# EAGLE design MovingTargetUnit_v5 (EAGLE 9.6.2)
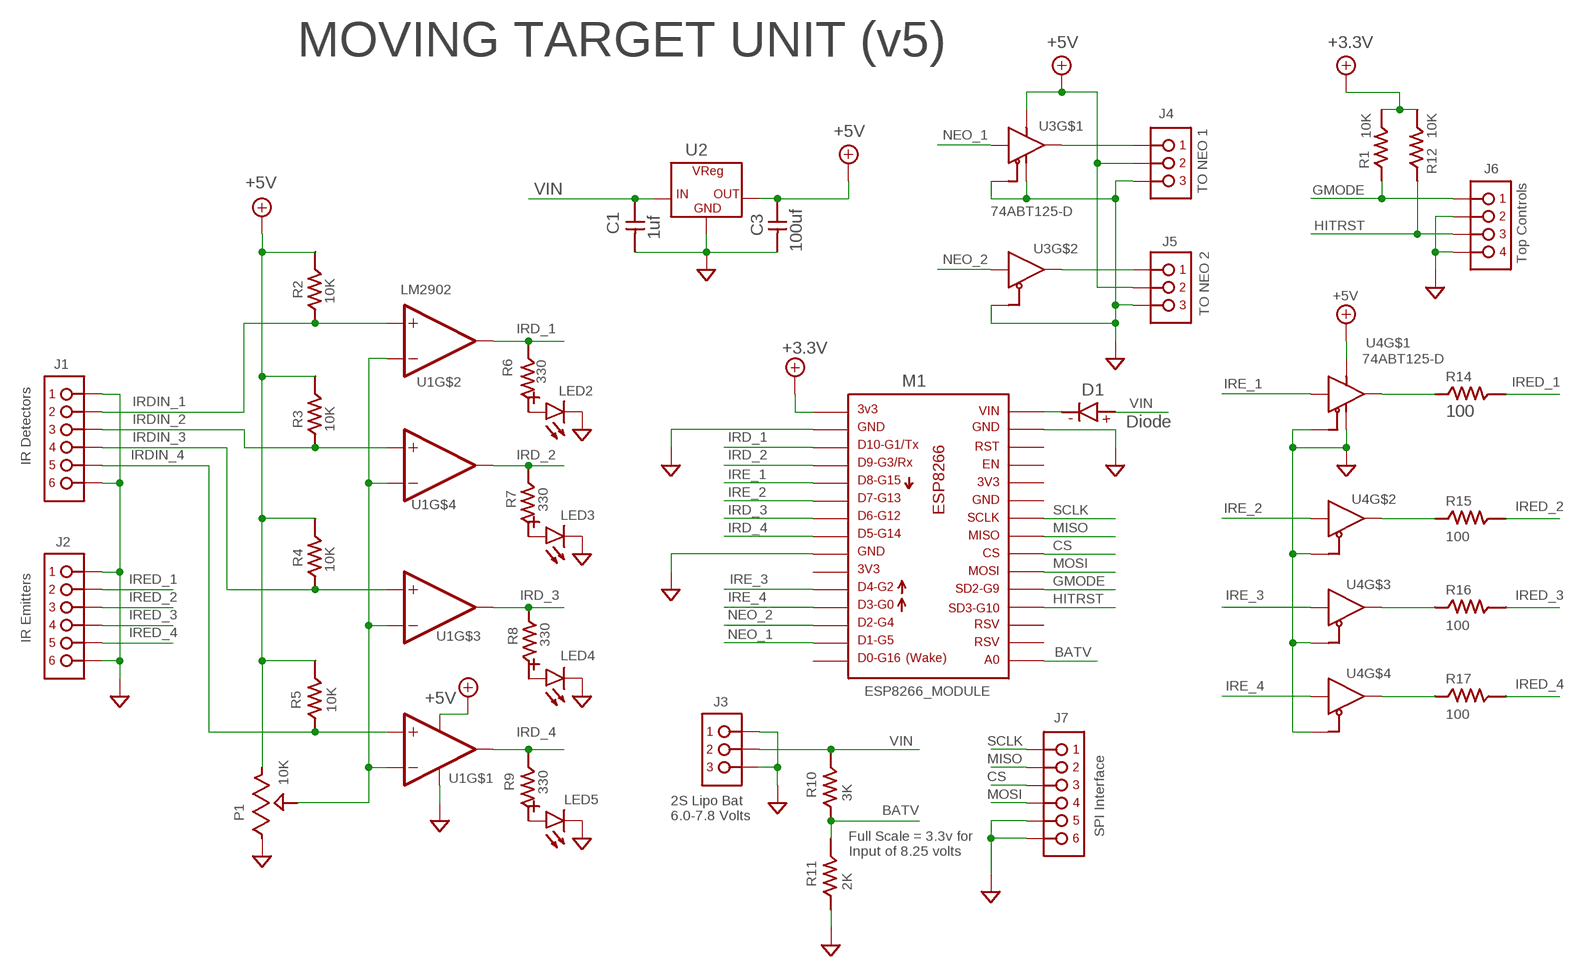
[diagram p0: schematic, sheet 1]

## Parts
C1  1uf  CAP1206  [C1206]
C3  100uf  CAP1206  [C1206]
D1  Diode  DIODE-SOD_87  [SOD-123_MINI-SMA]
J1  PINHDR_1X6-JST  [JST-XH_098_VERT_1X6]
J2  PINHDR_1X6-JST  [JST-XH_098_VERT_1X6]
J3  PINHDR_1X3XH-JST  [JST-XH_098_VERT_1X3]
J4  PINHDR_1X3XH-JST  [JST-XH_098_VERT_1X3]
J5  PINHDR_1X3XH-JST  [JST-XH_098_VERT_1X3]
J6  PINHDR_1X4-JST  [JST-XH_098_VERT_1X4]
J7  PINHDR_1X6-JST  [JST-XH_098_VERT_1X6]
LED2  LED1206  [LED_1206]
LED3  LED1206  [LED_1206]
LED4  LED1206  [LED_1206]
LED5  LED1206  [LED_1206]
M1  ESP8266_MODULE  [ESP8266_MODULE]
P1  10K  TRIMPOT-SM  [TRIMPOT_3361P]
R1  10K  R1206(3216METRIC)  [R1206]
R2  10K  R1206(3216METRIC)  [R1206]
R3  10K  R1206(3216METRIC)  [R1206]
R4  10K  R1206(3216METRIC)  [R1206]
R5  10K  R1206(3216METRIC)  [R1206]
R6  330  R1206(3216METRIC)  [R1206]
R7  330  R1206(3216METRIC)  [R1206]
R8  330  R1206(3216METRIC)  [R1206]
R9  330  R1206(3216METRIC)  [R1206]
R10  3K  R1206(3216METRIC)  [R1206]
R11  2K  R1206(3216METRIC)  [R1206]
R12  10K  R1206(3216METRIC)  [R1206]
R14  100  R1206(3216METRIC)  [R1206]
R15  100  R1206(3216METRIC)  [R1206]
R16  100  R1206(3216METRIC)  [R1206]
R17  100  R1206(3216METRIC)  [R1206]
U1  LM2902  [SO16LNB-14PIN]
U2  VREG-3-HS  [TO252-3-HS]
U3  74ABT125-D  [SO16LNB-14PIN]
U4  74ABT125-D  [SO16LNB-14PIN]

## Nets
+3.3V: M1.P$1 R1.P$2 R12.P$2
+5V: C3.P$2 J4.2 J5.2 P1.3 R2.P$2 R3.P$2 R4.P$2 R5.P$2 U1.P$4(P+) U2.3(OUT) U3.P$14(VCC) U4.P$14(VCC)
BATV: M1.P$16 R10.P$1 R11.P$2
CS: J7.4 M1.P$22
GMODE: J6.1 M1.P$20 R1.P$1
GND: C1.P$1 C3.P$1 J1.1 J1.6 J2.1 J2.6 J3.1 J3.3 J4.1 J5.1 J6.2 J6.4 J7.1 J7.2 LED2.CATHODE(-)(CATHODE) LED3.CATHODE(-)(CATHODE) LED4.CATHODE(-)(CATHODE) LED5.CATHODE(-)(CATHODE) M1.P$2 M1.P$9 M1.P$29 P1.1 R11.P$1 U1.P$11(P-) U2.FIN(GND) U3.P$1(OE) U3.P$4(OE) U3.P$7(GND) U4.P$1(OE) U4.P$4(OE) U4.P$7(GND) U4.P$10(OE) U4.P$13(OE)
HITRST: J6.3 M1.P$19 R12.P$1
IRD_1: M1.P$3 R6.P$2 U1.P$7(OUT)
IRD_2: M1.P$4 R7.P$2 U1.P$14(OUT)
IRD_3: M1.P$7 R8.P$1 U1.P$8(OUT)
IRD_4: M1.P$8 R9.P$2 U1.P$1(OUT)
IRDIN_1: J1.5 R2.P$1 U1.P$5(+IN)
IRDIN_2: J1.4 R3.P$1 U1.P$12(+IN)
IRDIN_3: J1.3 R4.P$1 U1.P$10(+IN)
IRDIN_4: J1.2 R5.P$1 U1.P$3(+IN)
IRE_1: M1.P$5 U4.P$2(IN)
IRE_2: M1.P$6 U4.P$5(IN)
IRE_3: M1.P$11 U4.P$9(IN)
IRE_4: M1.P$12 U4.P$12(IN)
IRED_1: J2.5 R14.P$2
IRED_2: J2.4 R15.P$2
IRED_3: J2.3 R16.P$2
IRED_4: J2.2 R17.P$2
IREDD_1: R14.P$1 U4.P$3(OUT)
IREDD_2: R15.P$1 U4.P$6(OUT)
IREDD_3: R16.P$1 U4.P$8(OUT)
IREDD_4: R17.P$1 U4.P$11(OUT)
MISO: J7.5 M1.P$23
MOSI: J7.3 M1.P$21
N$1: LED3.ANODE(+)(ANODE) R7.P$1
N$2: LED2.ANODE(+)(ANODE) R6.P$1
N$3: LED4.ANODE(+)(ANODE) R8.P$2
N$4: LED5.ANODE(+)(ANODE) R9.P$1
N$5: J5.3 U3.P$6(OUT)
N$6: J4.3 U3.P$3(OUT)
N$7: D1.C(CATHODE) M1.P$30
N$10: P1.2 U1.P$2(-IN) U1.P$6(-IN) U1.P$9(-IN) U1.P$13(-IN)
NEO_1: M1.P$14 U3.P$2(IN)
NEO_2: M1.P$13 U3.P$5(IN)
SCLK: J7.6 M1.P$24
VIN: C1.P$2 D1.A(ANODE) J3.2 R10.P$2 U2.1(IN)
Unconnected: M1.P$10 M1.P$15 M1.P$17 M1.P$18 M1.P$25 M1.P$26 M1.P$27 M1.P$28 U3.P$8(OUT) U3.P$9(IN) U3.P$10(OE) U3.P$11(OUT) U3.P$12(IN) U3.P$13(OE)

## Notes on the sheet
- MOVING TARGET UNIT (v5)
- Top Controls
- TO NEO 1
- TO NEO 2
- IR Detectors
- IR Emitters
- 2S Lipo Bat
  6.0-7.8 Volts
- SPI Interface
- Full Scale = 3.3v for 
  Input of 8.25 volts

## Library data of the parts
C1 C3 = Dal_V2:CAP
D1 = Dal_V2:DIODE
J1 J2 J7 = Dal_V2:PINHDR_1X6
J3-J5 = Dal_V2:PINHDR_1X3
J6 = Dal_V2:PINHDR_1X4
LED2-LED5 = Dal_V2:LED: Standard LED
M1 = Dal_V2:ESP8266_MODULE
P1 = Dal_V2:TRIMPOT
R1-R12 R14-R17 = Dal_V2:R: Standard Resistor -- Various Sizes and Wattages
U1 = Dal_V2:LM2902: Texas Instruments, LM2902KD
U2 = Dal_V2:VREG-3: 3 Pin Voltage Regulator
U3 U4 = Dal_V2:74ABT125

## Board
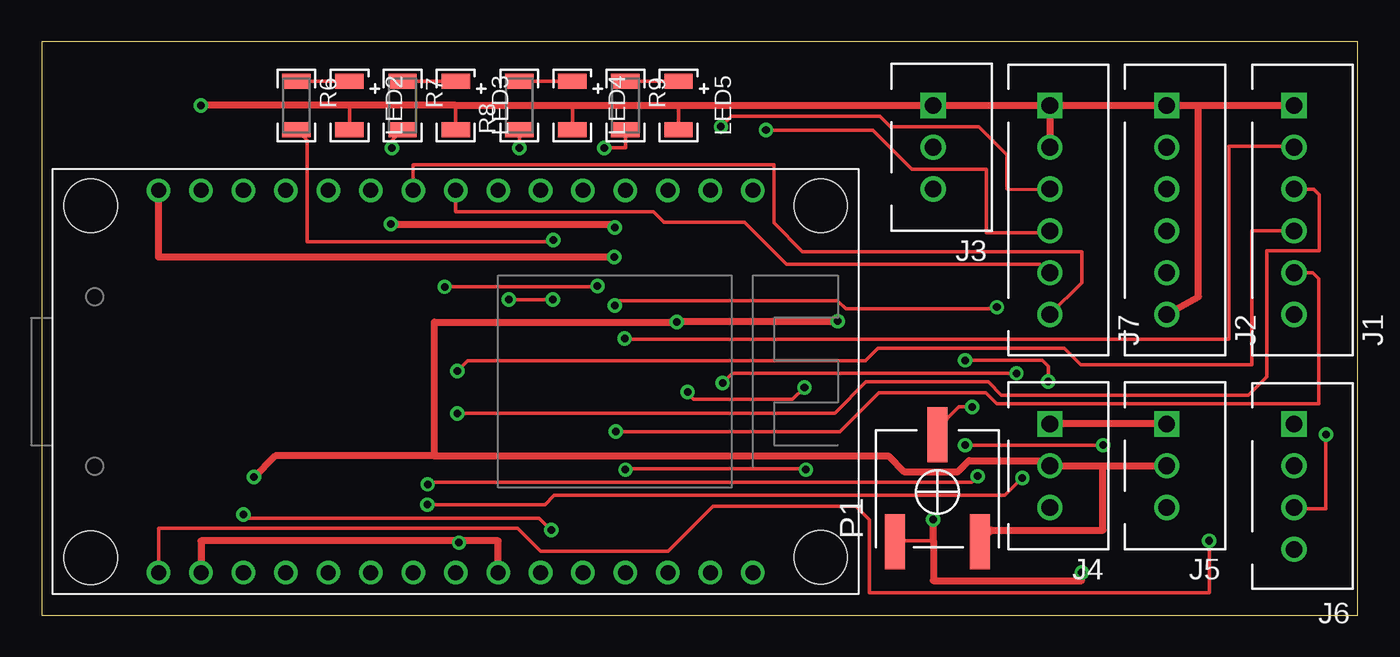
[diagram p1: board, top side]
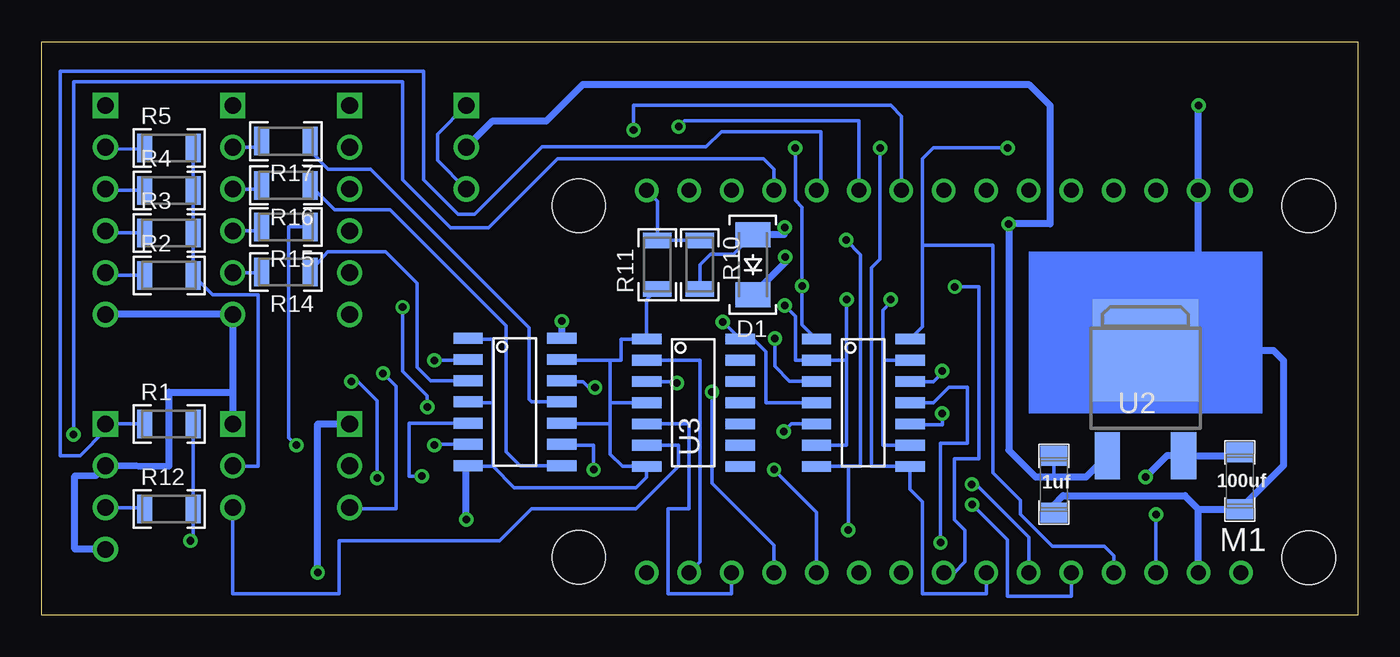
[diagram p2: board, bottom side, seen from below]

Size 78.74 x 34.29 mm. Coordinates in mm from the lower left corner, seen from the top.
Outline: 0,0 78.74,0 78.74,34.29 0,34.29 0,0
Copper layers (1*16): Top 0.035mm / dielectric 1.5mm / Bottom 0.035mm
Design rules "default *": minimum track width 8mil, minimum drill 0.44mm, track to track 8mil, track to pad 8mil, pad to pad 8mil, via to via 8mil, smd to smd 8mil, copper to edge 40mil, drill to drill 8mil, minimum pad ring 10mil, minimum via ring 8mil, stop-mask expansion 4mil, vias tented up to drill 0mil, thermal gap 10mil

### Footprints (pad centres in the part's own frame; a part is rotated, then mirrored left to right if it is on the bottom)
C1206 = smd 1.2 x 1.6: P$1 -1.7,0; P$2 1.7,0
SOD-123_MINI-SMA = smd 1.5 x 2.1: A 1.8,0; C -1.8,0
JST-XH_098_VERT_1X6 = drill 1 square: 1 0,0 | drill 1: 2 -2.5,0; 3 -5,0; 4 -7.5,0; 5 -10,0; 6 -12.5,0
JST-XH_098_VERT_1X3 = drill 1 square: 1 0,0 | drill 1: 2 -2.5,0; 3 -5,0
JST-XH_098_VERT_1X4 = drill 1 square: 1 0,0 | drill 1: 2 -2.5,0; 3 -5,0; 4 -7.5,0
LED_1206 = smd 0.9 x 1.7: ANODE(+) -1.45,0; CATHODE(-) 1.45,0
ESP8266_MODULE = drill 0.9: P$1 0,0; P$2 2.54,0; P$3 5.08,0; P$4 7.62,0; P$5 10.16,0; P$6 12.7,0; P$7 15.24,0; P$8 17.78,0; P$9 20.32,0; P$10 22.86,0; P$11 25.4,0; P$12 27.94,0; P$13 30.48,0; P$14 33.02,0; P$15 35.56,0; P$16 35.56,22.86; P$17 33.02,22.86; P$18 30.48,22.86; P$19 27.94,22.86; P$20 25.4,22.86; P$21 22.86,22.86; P$22 20.32,22.86; P$23 17.78,22.86; P$24 15.24,22.86; P$25 12.7,22.86; P$26 10.16,22.86; P$27 7.62,22.86; P$28 5.08,22.86; P$29 2.54,22.86; P$30 0,22.86 | hole 3.175: -4.064,21.946; -4.064,0.889; 39.624,21.946; 39.624,0.914
TRIMPOT_3361P = smd 1.2 x 3.3: 1 -2.54,-6.4; 2 0,0; 3 2.54,-6.4
R1206 = smd 0.9 x 1.7: P$1 -1.45,0; P$2 1.45,0
SO16LNB-14PIN = smd 1.75 x 0.65: P$1 0,0; P$2 0,-1.27; P$3 0,-2.54; P$4 0,-3.81; P$5 0,-5.08; P$6 0,-6.35; P$7 0,-7.62; P$8 5.6,-7.62; P$9 5.6,-6.35; P$10 5.6,-5.08; P$11 5.6,-3.81; P$12 5.6,-2.54; P$13 5.6,-1.27; P$14 5.6,0
TO252-3-HS = smd 1.5 x 2.8: 1 -2.28,-3.8; 3 2.28,-3.8 | smd 6.3 x 6.1: FIN 0,2.5

### Placement (x,y rotation side)
C1  18.19,7.82 90 bottom
C3  7.06,8.03 90 bottom
D1  36.2,20.95 90 bottom
J1  74.93,30.48 90 top
J2  67.31,30.48 90 top
J3  53.34,30.48 90 top
J4  60.33,11.43 90 top
J5  67.31,11.43 90 top
J6  74.93,11.43 90 top
J7  60.33,30.48 90 top
LED2  18.41,30.48 270 top
LED3  24.77,30.48 270 top
LED4  31.75,30.48 270 top
LED5  38.1,30.48 270 top
M1  6.99,2.54 0 top
P1  53.59,10.79 0 top
R1  71.12,11.43 0 bottom
R2  71.12,20.32 0 bottom
R3  71.12,22.86 0 bottom
R4  71.12,25.4 0 bottom
R5  71.12,27.94 0 bottom
R6  15.24,30.48 270 top
R7  21.59,30.48 270 top
R8  28.57,30.48 90 top
R9  34.92,30.48 270 top
R10  39.37,20.95 270 bottom
R11  41.91,20.95 90 bottom
R12  71.12,6.35 0 bottom
R14  64.14,20.52 180 bottom
R15  64.14,23.22 180 bottom
R16  64.14,25.7 180 bottom
R17  64.14,28.35 180 bottom
U1  32.38,16.51 0 bottom
U2  12.7,13.34 0 bottom
U3  42.55,16.51 0 bottom
U4  53.23,16.56 0 bottom

### Tracks (layer width: path | path; a pad name or v marks a point on that pad's centre or on a via)
+3.3V  (via drill 0.45)
  Top 0.203: M1.P$1 6.99,5.18 28.47,5.18 29.84,3.81 37.47,3.81 40.16,6.5 48.72,6.5 49.53,5.69 49.53,1.32 69.85,1.32 v69.85,4.45
  Bottom 0.203: R1.P$2 R12.P$2 69.67,4.62 v69.85,4.45
+5V  (via drill 0.45)
  Top 0.203: 37.85,17.55 37.82,17.53 v38,17.53
  Top 0.406: v12.7,8.26 13.97,9.53 23.5,9.53 | 23.5,9.53 50.66,9.53 51.6,8.59 54.83,8.59 55.48,9.24 60.02,9.24 J4.2 63.5,8.93 | 63.5,8.93 J5.2 | 23.5,9.53 23.5,17.53 v38,17.53 | v47.62,17.58 47.6,17.55 37.85,17.55 | P1.3 56.82,5.08 63.5,5.08 63.5,8.93
  Bottom 0.203: R5.P$2 R4.P$2 R3.P$2 R2.P$2 68.5,19.15 65.79,19.15 65.79,8.89 67.27,8.89 J5.2 | C3.P$2 7.25,9.54 | v38,17.53 37.96,17.53 U3.P$14 36.16,16.51 35.4,15.75 35.4,12.7 U1.P$4
  Bottom 0.406: v12.7,8.26 11.42,9.54 U2.3 7.25,9.54 | v47.62,17.58 U4.P$14
BATV
  Bottom 0.203: M1.P$16 41.91,24.77 R11.P$2 R10.P$1
CS  (via drill 0.45)
  Top 0.203: v43.33,29.01 49.73,29.01 52.07,26.67 56.52,26.67 56.52,22.86 60.2,22.86 J7.4
  Bottom 0.203: M1.P$22 27.3,29.84 27.94,30.48 43.33,30.48 v43.33,29.01
GMODE
  Bottom 0.203: R1.P$1 J6.1 74.93,11.05 76.45,9.53 77.62,9.53 77.62,32.54 55.88,32.54 55.88,26.04 53.82,23.98 52.86,23.98 48.82,28.02 38.99,28.02 38.08,28.92 32.13,28.92 32.13,25.65 M1.P$20
GND  (via drill 0.45)
  Top 0.203: LED2.CATHODE(-) 18.41,30.48 | 24.77,30.48 LED3.CATHODE(-) | LED4.CATHODE(-) 31.75,30.48 | 38.1,30.48 LED5.CATHODE(-) | P1.1 51.05,4.45 53.34,4.45 | 24.77,4.45 24.93,4.29 v24.97,4.33
  Top 0.406: J7.1 J3.1 38.1,30.48 31.75,30.48 24.77,30.48 18.41,30.48 v9.53,30.48 | J7.1 J2.1 69.22,30.48 | 69.22,30.48 J1.1 | J2.6 69.22,19.05 69.22,30.48 | J7.1 J7.2 | J5.1 J4.1 | M1.P$9 27.3,4.45 24.77,4.45 9.53,4.45 M1.P$2 | v62.23,2.54 62.23,2.06 53.34,2.06 53.34,4.45 v53.34,5.71
  Bottom 0.203: 51.74,8.89 53.17,8.89 U4.P$7 53.34,8.82 | U4.P$1 53.17,16.51 51.74,16.51 51.74,12.7 | 51.74,12.7 51.74,8.89 | J3.3 55.07,27.21 55.07,28.75 J3.1 | 44.73,11.43 44.73,9.63 43.99,8.89 U3.P$7 42.55,8.26 43.18,7.62 50.47,7.62 51.74,8.89 | 44.73,11.43 44.73,12.7 | 44.73,12.7 U3.P$4 | 44.73,12.7 44.73,15.24 | U4.P$13 47.58,15.24 44.73,15.24 | U4.P$10 47.58,11.43 44.73,11.43 | 44.73,15.24 44.09,15.24 44.09,16.51 U3.P$1 42.55,18.87 R11.P$1 | U4.P$4 53.17,12.7 51.74,12.7 | C1.P$1 18.19,6.58 | U1.P$11 25.4,12.7 24.46,13.64 23.34,13.64 23.34,10.29 24.97,10.29 v24.97,4.33
  Bottom 0.406: 67.31,13.34 J2.6 J1.6 | 67.31,13.34 J5.1 | 67.31,13.34 71.12,13.34 71.12,8.91 74.91,8.95 J6.2 75.5,8.36 76.76,8.33 76.76,3.94 J6.4 | M1.P$2 9.53,6.33 | v9.53,30.48 M1.P$29 9.53,19.01 U2.FIN 5.04,15.84 4.45,15.24 4.45,8.94 C3.P$1 9.53,6.33 | v62.23,2.54 62.23,11.43 J4.1 | v53.34,5.71 53.34,8.82 | 18.19,6.58 17.63,7.14 10.34,7.14 9.53,6.33
HITRST  (via drill 0.45)
  Top 0.203: J6.3 74.85,6.35 76.83,6.35 v76.83,10.79
  Bottom 0.203: R12.P$1 72.65,6.43 J6.3 | M1.P$19 34.92,26.67 35.56,27.3 47.88,27.3 52.02,23.16 54.28,23.16 57.15,26.04 57.15,31.9 76.83,31.9 v76.83,10.79
IRD_1  (via drill 0.45)
  Top 0.203: v30.61,22.43 30.5,22.33 15.88,22.33 15.88,28.39 R6.P$2 | v30.48,5.08 29.77,5.79 12.29,5.79 v12.06,6.02
  Bottom 0.203: U1.P$7 30.48,8.89 | 30.48,8.89 29.74,8.89 29.74,21.57 v30.61,22.43 | M1.P$3 v12.06,6.02 | v30.48,5.08 30.48,8.89
IRD_2  (via drill 0.45)
  Top 0.203: v20.95,27.94 20.95,28.39 R7.P$2
  Bottom 0.203: U1.P$14 26.04,17.26 26.04,22.12 | 26.04,22.12 26.04,27.3 25.4,27.94 v20.95,27.94 | 26.04,22.12 21.82,22.12 21.82,8.51 20.18,6.87 20.18,6.03 18.26,4.12 15.16,4.12 14.61,3.56 M1.P$4
IRD_3  (via drill 0.45)
  Top 0.203: v28.57,27.94 R8.P$1
  Bottom 0.203: M1.P$7 22.23,1.27 26.04,1.27 26.04,6.77 26.79,7.52 U1.P$8 29.08,8.89 29.08,20.78 28.57,21.29 v28.57,27.94
IRD_4  (via drill 0.45)
  Top 0.203: v24.11,19.63 33.2,19.63 v33.25,19.68 | v33.66,27.94 34.92,27.94 R9.P$2
  Bottom 0.203: U1.P$1 33.25,17.37 v33.25,19.68 33.25,24.4 33.66,24.8 v33.66,27.94 | v24.11,19.63 22.66,19.63 22.66,9.35 24.13,9.35 24.13,5.71 23.5,5.08 23.5,3.17 24.13,2.54 M1.P$8
IRDIN_1  (via drill 0.45)
  Top 0.203: J1.5 76.04,20.48 76.4,20.12 76.4,12.65 57.16,12.65 56.51,13.31 50.09,13.31 47.75,10.97 v34.34,10.97
  Bottom 0.203: R2.P$1 74.77,20.32 J1.5 | U1.P$5 33.88,11.43 v34.34,10.97
IRDIN_2  (via drill 0.45)
  Top 0.203: J1.4 72.41,22.98 72.42,22.85 72.42,14.99 62.18,14.99 61.2,15.97 50.03,15.97 49.28,15.21 25.47,15.21 v24.86,14.61
  Bottom 0.203: J1.4 74.83,22.88 74.48,22.86 R3.P$1 | U1.P$12 25.4,13.97 24.77,14.61 v24.86,14.61
IRDIN_3  (via drill 0.45)
  Top 0.203: v24.86,12.06 47.45,12.06 49.33,13.95 56.63,13.95 57.43,13.14 72.19,13.14 73.3,14.25 73.3,21.79 76.45,21.79 76.45,25.15 76.12,25.48 J1.3
  Bottom 0.203: R4.P$1 74.85,25.4 J1.3 | U1.P$10 26.73,11.38 24.86,11.38 v24.86,12.06
IRDIN_4  (via drill 0.45)
  Top 0.203: J1.2 74.87,28.04 71.02,28.04 71.02,16.51 65.15,16.51 34.9,16.51 v34.87,16.54
  Bottom 0.203: R5.P$1 72.66,27.85 74.84,27.89 J1.2 | U1.P$3 32.42,14 34,14 34.87,14.88 v34.87,16.54
IRE_1  (via drill 0.45)
  Top 0.203: v23.06,6.6 30.1,6.6 30.66,7.16 57.62,7.16 58.59,8.13 58.67,8.13 v58.67,8.2 | v55.24,15.24 59.87,15.24 60.22,14.88 v60.22,13.97
  Bottom 0.203: M1.P$5 17.14,1.12 20.95,1.12 20.95,4.5 v23.06,6.6 | v58.67,8.2 58.67,12.83 59.82,13.97 v60.22,13.97 | v55.24,15.24 53.27,15.24 U4.P$2
IRE_2  (via drill 0.45)
  Top 0.203: v23.09,7.82 23.22,7.95 55.65,7.95 v56.01,8.31
  Bottom 0.203: M1.P$6 19.68,4.65 22.86,7.82 v23.09,7.82 | v56.01,8.31 56.77,8.31 56.77,11.48 U4.P$5
IRE_3  (via drill 0.45)
  Top 0.203: v45.72,8.7 45.68,8.74 34.92,8.74 v34.92,8.7
  Bottom 0.203: U4.P$9 47.58,10.16 45.72,10.16 v45.72,8.7 | v34.92,8.7 32.38,6.16 M1.P$11
IRE_4  (via drill 0.45)
  Top 0.203: v38.64,13.34 38.64,13.26 39.01,12.89 44.92,12.89 v45.63,13.61
  Bottom 0.203: U4.P$12 47.58,13.97 46.35,13.97 45.99,13.61 v45.63,13.61 | v38.64,13.34 38.64,7.88 34.92,4.17 M1.P$12
IRED_1
  Bottom 0.203: J2.5 65.59,20.48 R14.P$2
IRED_2
  Bottom 0.203: J2.4 65.6,22.98 R15.P$2
IRED_3
  Bottom 0.203: J2.3 65.59,25.48 R16.P$2
IRED_4
  Bottom 0.203: J2.2 65.59,27.98 R17.P$2
IREDD_1
  Bottom 0.203: R14.P$1 61.64,21.74 58.17,21.74 56.28,19.85 56.28,14.84 55.46,14.02 U4.P$3
IREDD_2  (via drill 0.45)
  Top 0.203: v55.24,10.16 v63.5,10.16
  Bottom 0.203: v63.5,10.16 63.96,10.62 63.96,23.22 R15.P$1 | U4.P$6 55.2,10.21 v55.24,10.16
IREDD_3
  Bottom 0.203: U4.P$8 50.12,8.94 50.95,9.78 50.95,17.3 57.89,24.23 61.21,24.23 R16.P$1
IREDD_4
  Bottom 0.203: U4.P$11 49.43,12.75 49.58,12.9 49.58,17.2 59.05,26.67 61.59,26.67 62.69,27.76 R17.P$1
MISO
  Top 0.203: M1.P$23 24.77,24.13 36.59,24.13 37.23,23.5 42.04,23.5 44.55,20.98 59.72,20.98 60.22,20.48 J7.5
MOSI  (via drill 0.45)
  Top 0.203: J7.3 57.83,25.43 57.76,25.5 57.76,27.54 56.08,29.21 50.77,29.21 50.14,29.84 41.27,29.84 v40.64,29.21
  Bottom 0.203: v40.64,29.21 40.28,29.57 29.84,29.57 M1.P$21
N$1
  Top 0.203: R7.P$1 LED3.ANODE(+)
N$2
  Top 0.203: R6.P$1 LED2.ANODE(+)
N$3
  Top 0.203: LED4.ANODE(+) R8.P$2
N$4
  Top 0.203: R9.P$1 LED5.ANODE(+)
N$5
  Bottom 0.203: U3.P$6 40.64,10.16 40.64,8.89 43.18,6.35 49.44,6.35 51.34,4.45 60.96,4.45 60.96,1.27 67.31,1.27 J5.3
N$6  (via drill 0.45)
  Top 0.203: v58.32,14.46 41.32,14.46 v40.73,13.88
  Bottom 0.203: U3.P$3 40.64,13.97 v40.73,13.88 | v58.32,14.46 57.54,13.68 57.54,6.35 60.24,6.35 J4.3
N$7  (via drill 0.45)
  Top 0.406: M1.P$30 6.99,21.41 v34.27,21.41
  Bottom 0.406: v34.27,21.41 34.27,21.09 D1.C
N$10  (via drill 0.45)
  Top 0.203: v30.58,18.87 v27.95,18.87 | P1.2 53.59,11.15 54.89,12.45 v55.68,12.45 | v57.15,18.41 57.06,18.32 48.11,18.32 47.62,18.81 34.59,18.81 v34.29,18.51
  Bottom 0.203: 30.58,15.24 U1.P$2 33.66,15.24 33.66,17.87 v34.29,18.51 | 30.58,15.24 30.58,10.16 U1.P$6 | U1.P$9 28.42,10.16 28.42,15.24 | 28.42,15.24 U1.P$13 | 30.58,15.24 v30.58,18.87 | v27.95,18.87 27.95,18.72 28.42,18.25 28.42,15.24 | v55.68,12.45 55.68,13.11 57.15,14.58 v57.15,18.41
NEO_1
  Bottom 0.203: M1.P$14 39.37,3.17 39.37,15.24 U3.P$2
NEO_2
  Bottom 0.203: M1.P$13 37.47,1.27 41.27,1.27 41.27,6.35 40.01,6.35 40.01,11.43 U3.P$5
SCLK
  Top 0.203: M1.P$24 22.23,26.92 43.81,26.92 43.81,23.45 45.53,21.74 62.23,21.74 62.23,19.89 J7.6
VIN  (via drill 0.45)
  Top 0.406: v20.88,23.39 20.88,23.34 34.14,23.34 v34.29,23.19
  Bottom 0.203: 34.33,22.75 34.29,22.85 | R10.P$2 39.37,20.95 38.73,21.59 37.36,21.59 D1.A | C1.P$2 18.19,8.41 18.03,8.26
  Bottom 0.406: v34.29,23.19 34.29,22.85 | 34.33,22.75 D1.A | J3.2 51.77,29.55 48.55,29.55 46.35,31.75 19.68,31.75 18.41,30.48 18.41,23.39 v20.88,23.39 20.88,9.86 19.27,8.26 18.03,8.26 16.26,8.26 U2.1

### Text on the board
tValues: PWR: 6-9v | Epic Robotsz / Oct 2021 | EpicFMS | V2 | - + - | - + - | SPI | IR EMITTERS | IR DETECTORS | Hit Detector | dlb, v2. Epic Robotz | NEOPX 1 | NEOPX 2 | SWITCHES
bValues: Epic Robotz -- Oct 2021 -- EpicFMS -- Hit Detector -- V2 | 7805 | + | + | 74125 | 74125